# EAGLE schematic LED_Array (EAGLE 8.6.1)
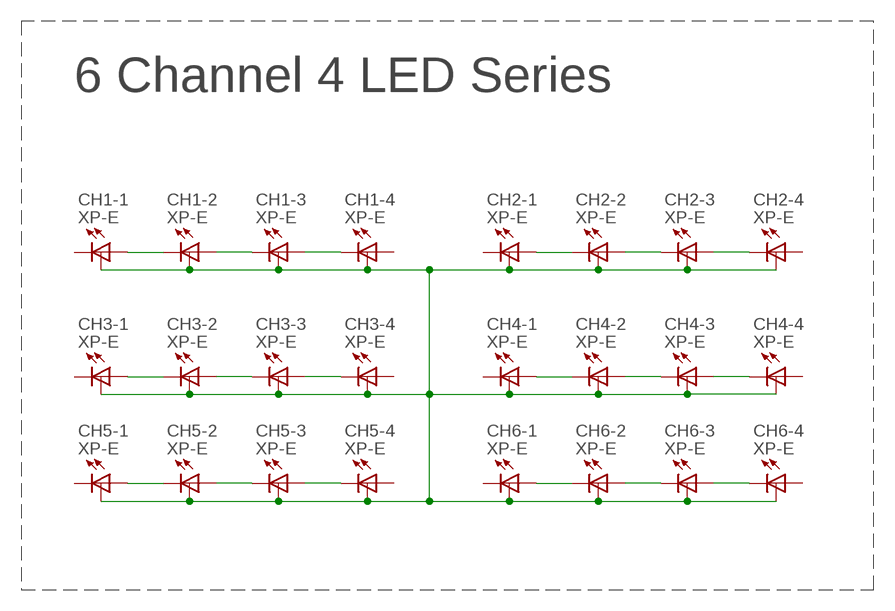
[diagram p0: schematic, sheet 1]

## Parts
CH1-1  XP-E  LED_W/THERM-XP-E  [CREE-XLAMP-XP-E]
CH1-2  XP-E  LED_W/THERM-XP-E  [CREE-XLAMP-XP-E]
CH1-3  XP-E  LED_W/THERM-XP-E  [CREE-XLAMP-XP-E]
CH1-4  XP-E  LED_W/THERM-XP-E  [CREE-XLAMP-XP-E]
CH2-1  XP-E  LED_W/THERM-XP-E  [CREE-XLAMP-XP-E]
CH2-2  XP-E  LED_W/THERM-XP-E  [CREE-XLAMP-XP-E]
CH2-3  XP-E  LED_W/THERM-XP-E  [CREE-XLAMP-XP-E]
CH2-4  XP-E  LED_W/THERM-XP-E  [CREE-XLAMP-XP-E]
CH3-1  XP-E  LED_W/THERM-XP-E  [CREE-XLAMP-XP-E]
CH3-2  XP-E  LED_W/THERM-XP-E  [CREE-XLAMP-XP-E]
CH3-3  XP-E  LED_W/THERM-XP-E  [CREE-XLAMP-XP-E]
CH3-4  XP-E  LED_W/THERM-XP-E  [CREE-XLAMP-XP-E]
CH4-1  XP-E  LED_W/THERM-XP-E  [CREE-XLAMP-XP-E]
CH4-2  XP-E  LED_W/THERM-XP-E  [CREE-XLAMP-XP-E]
CH4-3  XP-E  LED_W/THERM-XP-E  [CREE-XLAMP-XP-E]
CH4-4  XP-E  LED_W/THERM-XP-E  [CREE-XLAMP-XP-E]
CH5-1  XP-E  LED_W/THERM-XP-E  [CREE-XLAMP-XP-E]
CH5-2  XP-E  LED_W/THERM-XP-E  [CREE-XLAMP-XP-E]
CH5-3  XP-E  LED_W/THERM-XP-E  [CREE-XLAMP-XP-E]
CH5-4  XP-E  LED_W/THERM-XP-E  [CREE-XLAMP-XP-E]
CH6-1  XP-E  LED_W/THERM-XP-E  [CREE-XLAMP-XP-E]
CH6-2  XP-E  LED_W/THERM-XP-E  [CREE-XLAMP-XP-E]
CH6-3  XP-E  LED_W/THERM-XP-E  [CREE-XLAMP-XP-E]
CH6-4  XP-E  LED_W/THERM-XP-E  [CREE-XLAMP-XP-E]

## Nets
N$1: CH2-1.A CH2-1.A@1(A) CH2-2.C CH2-2.C@1(C)
N$2: CH2-2.A CH2-2.A@1(A) CH2-3.C CH2-3.C@1(C)
N$3: CH2-3.A CH2-3.A@1(A) CH2-4.C CH2-4.C@1(C)
N$4: CH4-1.A CH4-1.A@1(A) CH4-2.C CH4-2.C@1(C)
N$5: CH4-2.A CH4-2.A@1(A) CH4-3.C CH4-3.C@1(C)
N$6: CH4-3.A CH4-3.A@1(A) CH4-4.C CH4-4.C@1(C)
N$7: CH6-1.A CH6-1.A@1(A) CH6-2.C CH6-2.C@1(C)
N$8: CH6-2.A CH6-2.A@1(A) CH6-3.C CH6-3.C@1(C)
N$9: CH6-3.A CH6-3.A@1(A) CH6-4.C CH6-4.C@1(C)
N$10: CH1-1.A CH1-1.A@1(A) CH1-2.C CH1-2.C@1(C)
N$11: CH1-2.A CH1-2.A@1(A) CH1-3.C CH1-3.C@1(C)
N$12: CH1-3.A CH1-3.A@1(A) CH1-4.C CH1-4.C@1(C)
N$13: CH3-1.A CH3-1.A@1(A) CH3-2.C CH3-2.C@1(C)
N$14: CH3-2.A CH3-2.A@1(A) CH3-3.C CH3-3.C@1(C)
N$15: CH3-3.A CH3-3.A@1(A) CH3-4.C CH3-4.C@1(C)
N$16: CH5-1.A CH5-1.A@1(A) CH5-2.C CH5-2.C@1(C)
N$17: CH5-2.A CH5-2.A@1(A) CH5-3.C CH5-3.C@1(C)
N$18: CH5-3.A CH5-3.A@1(A) CH5-4.C CH5-4.C@1(C)
T: CH1-1.THERM CH1-2.THERM CH1-3.THERM CH1-4.THERM CH2-1.THERM CH2-2.THERM CH2-3.THERM CH2-4.THERM CH3-1.THERM CH3-2.THERM CH3-3.THERM CH3-4.THERM CH4-1.THERM CH4-2.THERM CH4-3.THERM CH4-4.THERM CH5-1.THERM CH5-2.THERM CH5-3.THERM CH5-4.THERM CH6-1.THERM CH6-2.THERM CH6-3.THERM CH6-4.THERM
Unconnected: CH1-1.C CH1-1.C@1(C) CH1-4.A CH1-4.A@1(A) CH2-1.C CH2-1.C@1(C) CH2-4.A CH2-4.A@1(A) CH3-1.C CH3-1.C@1(C) CH3-4.A CH3-4.A@1(A) CH4-1.C CH4-1.C@1(C) CH4-4.A CH4-4.A@1(A) CH5-1.C CH5-1.C@1(C) CH5-4.A CH5-4.A@1(A) CH6-1.C CH6-1.C@1(C) CH6-4.A CH6-4.A@1(A)

## Notes on the sheet
- 6 Channel 4 LED Series

## Library data of the parts
CH1-1-CH1-4 CH2-1-CH2-4 CH3-1-CH3-4 CH4-1-CH4-4 CH5-1-CH5-4 CH6-1-CH6-4 = Tomaszewski:LED_W/THERM